# Altium schematic sheet 4layer schematic.SchDoc: Power Bank   by Abdelrahman Ahmed (part 3 of 3)
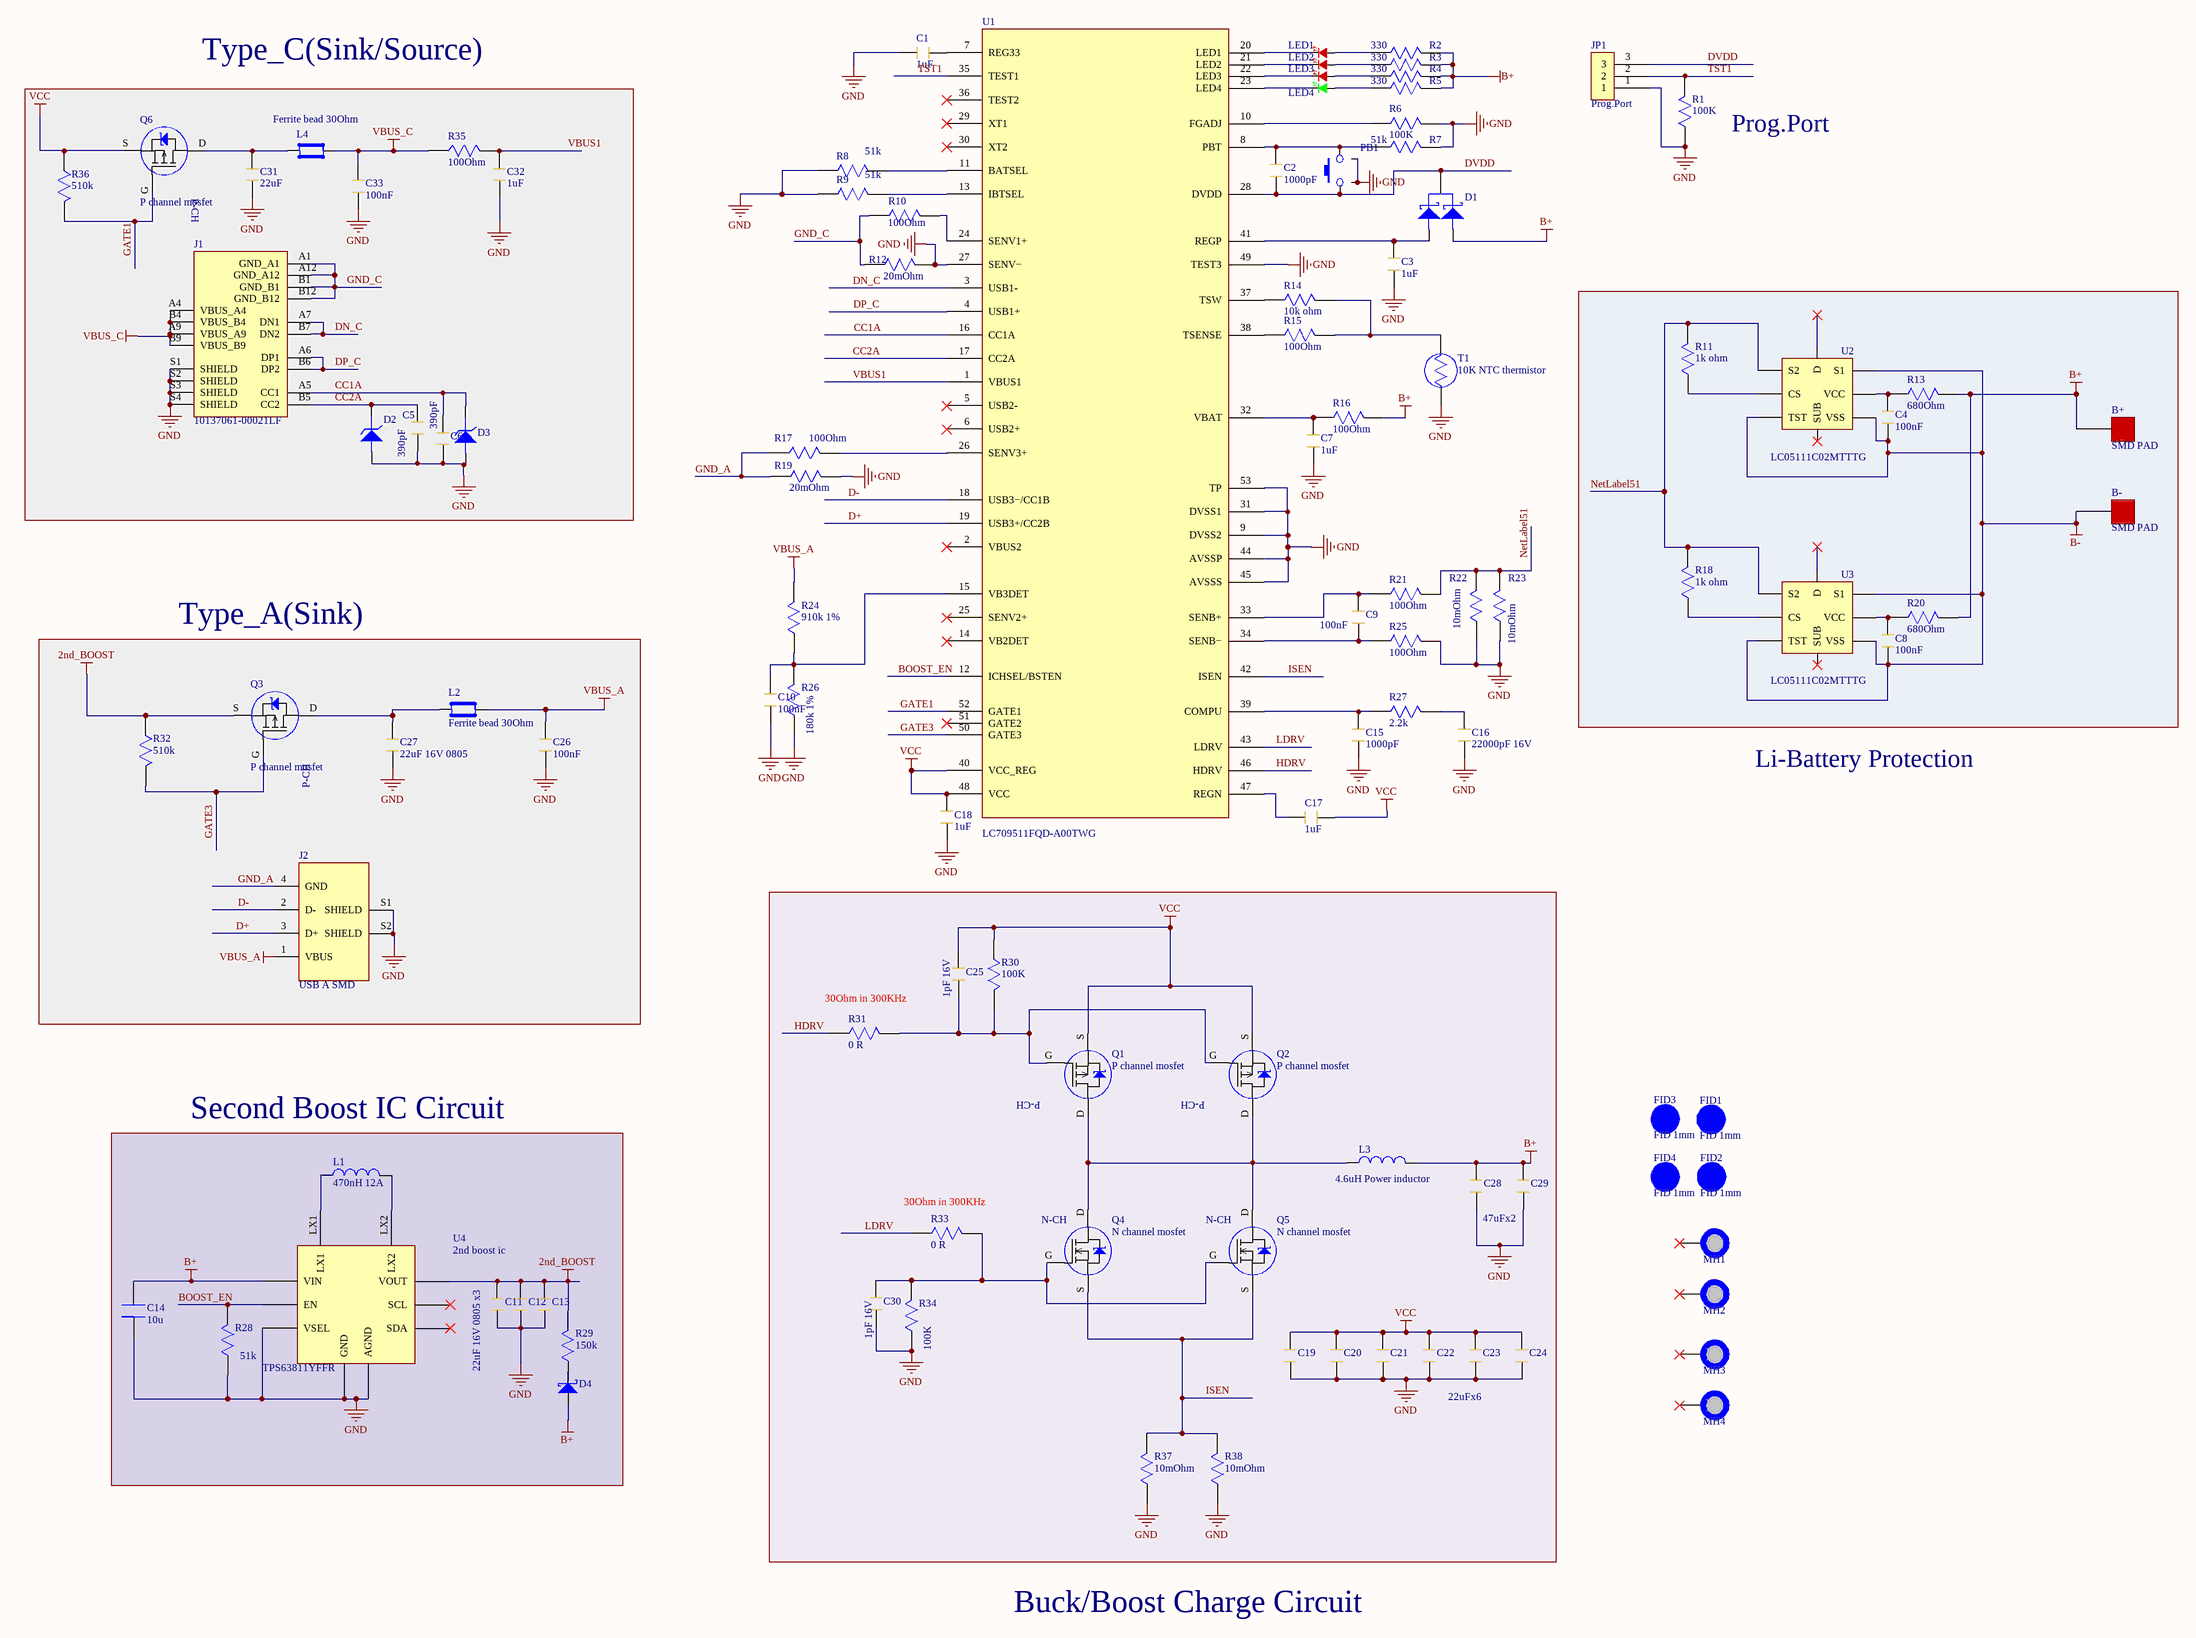
[diagram p2: 4layer schematic.SchDoc]

## Library data of the parts (continued)
R7-R9 R28 = CRCW080551K0JNEA: RES, THICK FILM, 51K, 5%, 0.125W, 0805, REEL; Product Range:AEC-Q200 CRCW Series; Resistance:51kohm; Power Rating:125mW; Resistance Tolerance: 5%; Voltage Rating:150V; Resistor Case Style:0805 [2012 Metric]; Packaging:Tape & Reel ;RoHS Compliant: Yes; Manufacturer 1: Vishay Dale; Resistance: 51kR; Power Rating: 125mW; Voltage Rating: 150V; Temperature Coefficient: 200ppm/°C; Supplier 1: Digi-Key; Manufacturer Part Number 1: CRCW080551K0JNEA; Stock 1: 39035; Pricing 1: 1=0.10000, 10=0.03800, 100=0.01560, 1000=0.00702, 2500=0.00610 (USD); RoHS: Yes; Case/Package: 0805; Number of Pins: 2; Weight: 0.000194oz; Case Code (Imperial): 0805; Case Code (Metric): 2012; Contact Plating: Tin; Min Operating Temperature: -55°C; Max Operating Temperature: 155°C; Tolerance: 5%; Packaging: Tape and Reel; Package Quantity: 1; Termination: SMD/SMT; Composition: Thick Film; Number of Terminations: 2; Military Standard: Not; Max Power Dissipation: 125mW; Voltage Rating (DC): 150V; Features: Automotive AEC-Q200; Working Voltage: 150V; Length: 2mm; Height: 0.02inch; Width: 1.25mm; Depth: 1.25mm; Radiation Hardening: No; REACH SVHC: Unknown; Lead Free: Lead Free; ComponentLink1URL: https://datasheet.ciiva.com/9002/dcrcwe3-9002680.pdf?src-supplier=Avnet; ComponentLink1Description: https://datasheet.ciiva.com/9002/dcrcwe3-9002680.pdf?src-supplier=Avnet; ComponentLink2URL: https://datasheet.ciiva.com/2464/dcrcwe3-2464858.pdf?src-supplier=Digi-Key; ComponentLink2Description: https://datasheet.ciiva.com/2464/dcrcwe3-2464858.pdf?src-supplier=Digi-Key; ComponentLink3URL: https://datasheet.ciiva.com/2464/dcrcwe3-2464859.pdf?src-supplier=Digi-Key; ComponentLink3Description: https://datasheet.ciiva.com/2464/dcrcwe3-2464859.pdf?src-supplier=Digi-Key; ComponentLink4URL: https://datasheet.ciiva.com/2464/dcrcwe3-2464860.pdf?src-supplier=Digi-Key; ComponentLink4Description: https://datasheet.ciiva.com/2464/dcrcwe3-2464860.pdf?src-supplier=Digi-Key; Supplier Part Number 1: 541-51KACT-ND
R10 R15-R17 R21 R25 R35 = ESR03EZPJ101: ROHM - ESR03EZPJ101 - SMD Chip Resistor, Anti-Surge, 0603 [1608 Metric], 100 ohm, ESR Series, 150 V, Thick Film, 250 mW - SMD Chip Resistor, Anti-Surge, 0603 [1608 Metric], 100 ohm, ESR Series, 150 V, Thick Film, 250 mW; Temperature Coefficient: 200ppm/°C; Power Rating: 200mW; Resistance: 100R; Tolerance: 5%; Supplier 1: Digi-Key; Manufacturer 1: Rohm; Manufacturer Part Number 1: ESR03EZPJ101; Stock 1: 68293; Pricing 1: 1=0.10000, 10=0.07600, 100=0.02920, 1000=0.01283, 2500=0.01108 (USD); RoHS: Yes; Case/Package: 0603; Lead Free: Lead Free; ComponentLink1URL: https://datasheet.ciiva.com/16218/esr-16218543.pdf?src-supplier=Future+Electronics; ComponentLink1Description: https://datasheet.ciiva.com/16218/esr-16218543.pdf?src-supplier=Future+Electronics; Supplier Part Number 1: RHM100DCT-ND
R11 R18 = RC0805FR-071KL: RES SMD 1K OHM 1% 1/8W 0805; Manufacturer 1: Yageo; Resistance: 1kR; Temperature Coefficient: 100ppm/°C; Voltage Rating (DC): 150V; Power Rating: 125mW; Supplier 1: Digi-Key; Manufacturer Part Number 1: RC0805FR-071KL; Stock 1: 26611077; Pricing 1: 1=0.10000, 10=0.04200, 100=0.01700, 1000=0.00762, 2500=0.00662 (USD); RoHS: Yes; Case/Package: 0805; Number of Pins: 2; Case Code (Metric): 2012; Case Code (Imperial): 0805; Min Operating Temperature: -55°C; Max Operating Temperature: 155°C; Tolerance: 1%; Packaging: Tape and Reel; Composition: Thick Film; Package Quantity: 1; Voltage Rating: 150V; Number of Terminations: 2; Termination: SMD/SMT; Military Standard: Not; Max Power Dissipation: 125mW; Features: Moisture Resistant; Length: 0.079inch; Height: 0.024inch; Width: 0.049inch; Depth: 1.25mm; REACH SVHC: Unknown; Lead Free: Lead Free; ComponentLink1URL: https://datasheet.ciiva.com/2456/pyu-r-int-thick-7-2456976.pdf?src-supplier=Digi-Key; ComponentLink1Description: https://datasheet.ciiva.com/2456/pyu-r-int-thick-7-2456976.pdf?src-supplier=Digi-Key; ComponentLink2URL: https://datasheet.ciiva.com/2456/pyu-r-int-thick-7-2456977.pdf?src-supplier=Digi-Key; ComponentLink2Description: https://datasheet.ciiva.com/2456/pyu-r-int-thick-7-2456977.pdf?src-supplier=Digi-Key; ComponentLink3URL: https://datasheet.ciiva.com/7941/1686128-7941719.pdf?src-supplier=Element14; ComponentLink3Description: https://datasheet.ciiva.com/7941/1686128-7941719.pdf?src-supplier=Element14; ComponentLink4URL: https://datasheet.ciiva.com/16850/rc0805-16850409.pdf?src-supplier=Future+Electronics; ComponentLink4Description: https://datasheet.ciiva.com/16850/rc0805-16850409.pdf?src-supplier=Future+Electronics; ComponentLink5URL: https://datasheet.ciiva.com/46385/444164-46385020.pdf?src-supplier=Element14; ComponentLink5Description: https://datasheet.ciiva.com/46385/444164-46385020.pdf?src-supplier=Element14; ComponentLink6URL: https://datasheet.ciiva.com/2456/pyu-r-int-thick-7-2456975.pdf?src-supplier=Digi-Key; ComponentLink6Description: https://datasheet.ciiva.com/2456/pyu-r-int-thick-7-2456975.pdf?src-supplier=Digi-Key; Supplier Part Number 1: 311-1.00KCRCT-ND
R12 R19 = ERJ8CWFR020V: PANASONIC - ERJ8CWFR020V - SMD Current Sense Resistors, AEC-Q200 ERJ Series, 0.02 ohm, 1 W, - 1% RoHS Compliant: Yes; Resistance: 20mR; Power Rating: 1W; Temperature Coefficient: 75ppm/°C; Supplier 1: Digi-Key; Manufacturer 1: Panasonic; Manufacturer Part Number 1: ERJ8CWFR020V; Stock 1: 13226; Pricing 1: 1=0.59000, 10=0.45200, 100=0.19000, 1000=0.10482, 2500=0.09826 (USD); RoHS: Yes; Mount: Surface Mount; Case/Package: 1206; Case Code (Metric): 3216; Case Code (Imperial): 1206; Min Operating Temperature: -55°C; Max Operating Temperature: 155°C; Tolerance: 1%; Packaging: Cut Tape; Composition: Thick Film; Number of Terminations: 2; Termination: Flat; Max Power Dissipation: 1W; Features: Automotive AEC-Q200; Length: 0.126inch; Height: 0.03inch; Width: 0.063inch; Depth: 1.6mm; REACH SVHC: No SVHC; Lead Free: Lead Free; ComponentLink1URL: https://datasheet.ciiva.com/25608/0900766b81107548-25608662.pdf?src-supplier=RSComponents; ComponentLink1Description: https://datasheet.ciiva.com/25608/0900766b81107548-25608662.pdf?src-supplier=RSComponents; ComponentLink2URL: https://datasheet.ciiva.com/7942/1790602-7942325.pdf?src-supplier=Element14; ComponentLink2Description: https://datasheet.ciiva.com/7942/1790602-7942325.pdf?src-supplier=Element14; ComponentLink3URL: https://datasheet.ciiva.com/48532/erj8cw-eng-tds-48532710.pdf?src-supplier=Distrelec; ComponentLink3Description: https://datasheet.ciiva.com/48532/erj8cw-eng-tds-48532710.pdf?src-supplier=Distrelec; ComponentLink4URL: https://datasheet.ciiva.com/6028/1790602-6028444.pdf?src-supplier=Farnell; ComponentLink4Description: https://datasheet.ciiva.com/6028/1790602-6028444.pdf?src-supplier=Farnell; Supplier Part Number 1: P0.02BVCT-ND
R13 R20 = 680Ohm 1/8 watt: PANASONIC ELECTRONIC COMPONENTS         ERJ6ENF6800V            Surface Mount Chip Resistor, Thick Film, AEC-Q200 ERJ6E Series, 680 ohm, 125 mW,  1%, 150 V; Resistance: 680R; Power Rating: 125mW; Voltage Rating: 150V; Temperature Coefficient: 100ppm/°C; Supplier 1: Digi-Key; Manufacturer 1: Panasonic; Manufacturer Part Number 1: ERJ6ENF6800V; Stock 1: 52236; Pricing 1: 1=0.10000, 10=0.07200, 100=0.02750, 1000=0.01210, 2500=0.01045 (USD); RoHS: Yes; Mount: Surface Mount; Case/Package: 0805; Number of Pins: 2; Case Code (Metric): 2012; Case Code (Imperial): 0805; Contact Plating: Tin; Min Operating Temperature: -55°C; Max Operating Temperature: 155°C; Packaging: Tape and Reel; Tolerance: 1%; Composition: Thick Film; Package Quantity: 1; Number of Terminations: 2; Termination: SMD/SMT; Military Standard: Not; Max Power Dissipation: 125mW; Features: Automotive AEC-Q200; Length: 2mm; Height: 0.6mm; Width: 0.049inch; Depth: 1.25mm; Radiation Hardening: No; REACH SVHC: No SVHC; ComponentLink1URL: https://datasheet.ciiva.com/11821/0900766b80f80784-11821688.pdf?src-supplier=RSComponents; ComponentLink1Description: https://datasheet.ciiva.com/11821/0900766b80f80784-11821688.pdf?src-supplier=RSComponents; ComponentLink2URL: https://datasheet.ciiva.com/7944/426256-7944661.pdf?src-supplier=Element14; ComponentLink2Description: https://datasheet.ciiva.com/7944/426256-7944661.pdf?src-supplier=Element14; ComponentLink3URL: https://datasheet.ciiva.com/16787/70260748-16787589.pdf?src-supplier=Allied+Electronics; ComponentLink3Description: https://datasheet.ciiva.com/16787/70260748-16787589.pdf?src-supplier=Allied+Electronics; ComponentLink4URL: https://datasheet.ciiva.com/17205/aoa0000ce2-17205287.pdf?src-supplier=Avnet+Europe; ComponentLink4Description: https://datasheet.ciiva.com/17205/aoa0000ce2-17205287.pdf?src-supplier=Avnet+Europe; ComponentLink5URL: https://datasheet.ciiva.com/7944/426256-7944953.pdf?src-supplier=Element14; ComponentLink5Description: https://datasheet.ciiva.com/7944/426256-7944953.pdf?src-supplier=Element14; ComponentLink6URL: https://datasheet.ciiva.com/5860/426256-5860698.pdf?src-supplier=Farnell; ComponentLink6Description: https://datasheet.ciiva.com/5860/426256-5860698.pdf?src-supplier=Farnell; ComponentLink7URL: https://datasheet.ciiva.com/16512/aoa0000ce2-16512058.pdf?src-supplier=Avnet+Asia; ComponentLink7Description: https://datasheet.ciiva.com/16512/aoa0000ce2-16512058.pdf?src-supplier=Avnet+Asia; ComponentLink8URL: https://datasheet.ciiva.com/9180/aoa0000ce2-9180429.pdf?src-supplier=Avnet; ComponentLink8Description: https://datasheet.ciiva.com/9180/aoa0000ce2-9180429.pdf?src-supplier=Avnet; ComponentLink9URL: https://datasheet.ciiva.com/16757/70260748-16757933.pdf?src-supplier=Allied+Electronics; ComponentLink9Description: https://datasheet.ciiva.com/16757/70260748-16757933.pdf?src-supplier=Allied+Electronics; ComponentLink10URL: https://datasheet.ciiva.com/30107/aoa0000ce2-30107005.pdf?src-supplier=Onlinecomponents.com; ComponentLink10Description: https://datasheet.ciiva.com/30107/aoa0000ce2-30107005.pdf?src-supplier=Onlinecomponents.com; ComponentLink11URL: https://datasheet.ciiva.com/46373/1678782-46373886.pdf?src-supplier=Element14; ComponentLink11Description: https://datasheet.ciiva.com/46373/1678782-46373886.pdf?src-supplier=Element14; ComponentLink12URL: https://datasheet.ciiva.com/46373/1678782-46373887.pdf?src-supplier=Element14; ComponentLink12Description: https://datasheet.ciiva.com/46373/1678782-46373887.pdf?src-supplier=Element14; Supplier Part Number 1: P680CCT-ND
R14 = RC0805FR-0710KL: RES SMD 10K OHM 1% 1/8W 0805; Manufacturer 1: Yageo; Resistance: 10kR; Temperature Coefficient: 100ppm/°C; Power Rating: 125mW; Voltage Rating: 150V; Supplier 1: Digi-Key; Manufacturer Part Number 1: RC0805FR-0710KL; Stock 1: 38785407; Pricing 1: 1=0.10000, 10=0.04200, 100=0.01700, 1000=0.00762, 2500=0.00662 (USD); RoHS: Yes; Case/Package: 0805; Case Code (Imperial): 0805; Case Code (Metric): 2012; Min Operating Temperature: -55°C; Max Operating Temperature: 155°C; Tolerance: 1%; Composition: Thick Film; Packaging: Tape and Reel; Package Quantity: 1; Termination: SMD/SMT; Number of Terminations: 2; Military Standard: Not; Max Power Dissipation: 125mW; Features: Moisture Resistant; Length: 2mm; Height: 0.024inch; Width: 0.049inch; Depth: 1.25mm; REACH SVHC: Unknown; Lead Free: Lead Free; ComponentLink1URL: https://datasheet.ciiva.com/11808/0900766b8106beab-11808151.pdf?src-supplier=RSComponents; ComponentLink1Description: https://datasheet.ciiva.com/11808/0900766b8106beab-11808151.pdf?src-supplier=RSComponents; ComponentLink2URL: https://datasheet.ciiva.com/12669/rc0805-12669688.pdf?src-supplier=Mouser; ComponentLink2Description: https://datasheet.ciiva.com/12669/rc0805-12669688.pdf?src-supplier=Mouser; ComponentLink3URL: https://datasheet.ciiva.com/46447/444164-46447563.pdf?src-supplier=Element14; ComponentLink3Description: https://datasheet.ciiva.com/46447/444164-46447563.pdf?src-supplier=Element14; ComponentLink4URL: https://datasheet.ciiva.com/2456/pyu-r-int-thick-7-2456972.pdf?src-supplier=Digi-Key; ComponentLink4Description: https://datasheet.ciiva.com/2456/pyu-r-int-thick-7-2456972.pdf?src-supplier=Digi-Key; ComponentLink5URL: https://datasheet.ciiva.com/2456/pyu-r-int-thick-7-2456973.pdf?src-supplier=Digi-Key; ComponentLink5Description: https://datasheet.ciiva.com/2456/pyu-r-int-thick-7-2456973.pdf?src-supplier=Digi-Key; ComponentLink6URL: https://datasheet.ciiva.com/2456/pyu-r-int-thick-7-2456974.pdf?src-supplier=Digi-Key; ComponentLink6Description: https://datasheet.ciiva.com/2456/pyu-r-int-thick-7-2456974.pdf?src-supplier=Digi-Key; ComponentLink7URL: https://datasheet.ciiva.com/16747/rc0805-16747087.pdf?src-supplier=Future+Electronics; ComponentLink7Description: https://datasheet.ciiva.com/16747/rc0805-16747087.pdf?src-supplier=Future+Electronics; Supplier Part Number 1: 311-10.0KCRCT-ND
R22 R23 R37 R38 = ERJ-8BWFR010V: PANASONIC - ERJ-8BWFR010V - SMD Current Sense Resistor, 0.01 ohm, ERJ8B Series, 1206 [3216 Metric], 1 W, ± 1%, Thick Film; Resistance: 10mR; Power Rating: 1W; Temperature Coefficient: 200ppm/°C; Supplier 1: Digi-Key; Manufacturer 1: Panasonic; Manufacturer Part Number 1: ERJ-8BWFR010V; Stock 1: 16754; Pricing 1: 1=0.60000, 10=0.50000, 100=0.33550, 1000=0.19632, 2500=0.19418 (USD); RoHS: Yes; Mount: Surface Mount; Case/Package: 1206; Case Code (Imperial): 1206; Case Code (Metric): 3216; Contact Plating: Tin; Min Operating Temperature: -55°C; Max Operating Temperature: 155°C; Tolerance: 1%; Packaging: Tape and Reel; Package Quantity: 1; Composition: Thick Film,Low-Ohm-Resistor; Termination: SMD/SMT; Number of Terminations: 2; Military Standard: Not; Max Power Dissipation: 1W; Features: Automotive AEC-Q200; Length: 3.2mm; Height: 0.65mm; Width: 1.6mm; Depth: 1.6mm; Radiation Hardening: No; REACH SVHC: No SVHC; Lead Free: Lead Free; ComponentLink1URL: https://datasheet.ciiva.com/11811/0900766b8126441d-11811746.pdf?src-supplier=RSComponents; ComponentLink1Description: https://datasheet.ciiva.com/11811/0900766b8126441d-11811746.pdf?src-supplier=RSComponents; ComponentLink2URL: https://datasheet.ciiva.com/9194/aoa0000ce3-9194119.pdf?src-supplier=Avnet; ComponentLink2Description: https://datasheet.ciiva.com/9194/aoa0000ce3-9194119.pdf?src-supplier=Avnet; ComponentLink3URL: https://datasheet.ciiva.com/30095/6aoa0000ce3-30095514.pdf?src-supplier=Onlinecomponents.com; ComponentLink3Description: https://datasheet.ciiva.com/30095/6aoa0000ce3-30095514.pdf?src-supplier=Onlinecomponents.com; ComponentLink4URL: https://datasheet.ciiva.com/48532/erj-eng-tds-48532746.pdf?src-supplier=Distrelec; ComponentLink4Description: https://datasheet.ciiva.com/48532/erj-eng-tds-48532746.pdf?src-supplier=Distrelec; ComponentLink5URL: https://datasheet.ciiva.com/2451/aoa0000ce3-2451517.pdf?src-supplier=Digi-Key; ComponentLink5Description: https://datasheet.ciiva.com/2451/aoa0000ce3-2451517.pdf?src-supplier=Digi-Key; ComponentLink6URL: https://datasheet.ciiva.com/2451/aoa0000ce3-2451518.pdf?src-supplier=Digi-Key; ComponentLink6Description: https://datasheet.ciiva.com/2451/aoa0000ce3-2451518.pdf?src-supplier=Digi-Key; ComponentLink7URL: https://datasheet.ciiva.com/17212/aoa0000ce3-17212030.pdf?src-supplier=Avnet+Europe; ComponentLink7Description: https://datasheet.ciiva.com/17212/aoa0000ce3-17212030.pdf?src-supplier=Avnet+Europe; ComponentLink8URL: https://datasheet.ciiva.com/2451/aoa0000ce3-2451519.pdf?src-supplier=Digi-Key; ComponentLink8Description: https://datasheet.ciiva.com/2451/aoa0000ce3-2451519.pdf?src-supplier=Digi-Key; ComponentLink9URL: https://datasheet.ciiva.com/28532/39793-28532991.pdf?src-supplier=Element14; ComponentLink9Description: https://datasheet.ciiva.com/28532/39793-28532991.pdf?src-supplier=Element14; Supplier Part Number 1: P.010AUCT-ND
R24 = ERJ-6ENF9101V: Res Thick Film 0805 9.1K Ohm 1% 1/8W +/-100ppm/ßC Molded SMD Punched Carrier T/R; Manufacturer 1: Panasonic; Resistance: 9.1kR; Power Rating: 125mW; Voltage Rating: 150V; Temperature Coefficient: 100ppm/°C; Supplier 1: Digi-Key; Manufacturer Part Number 1: ERJ-6ENF9101V; Stock 1: 3180; Pricing 1: 1=0.10000, 10=0.07200, 100=0.02750, 1000=0.01210, 2500=0.01045 (USD); RoHS: Yes; Mount: Surface Mount; Case/Package: 0805; Case Code (Imperial): 0805; Case Code (Metric): 2012; Contact Plating: Tin; Min Operating Temperature: -55°C; Max Operating Temperature: 155°C; Tolerance: 1%; Packaging: Tape and Reel; Package Quantity: 1; Composition: Thick Film; Number of Terminations: 2; Military Standard: Not; Max Power Dissipation: 125mW; Features: Automotive AEC-Q200; Termination: SMD/SMT; Voltage Rating (DC): 150V; Length: 2mm; Height: 0.6mm; Width: 1.2mm; Depth: 1.25mm; Radiation Hardening: No; REACH SVHC: No SVHC; Lead Free: Lead Free; ComponentLink1URL: https://datasheet.ciiva.com/11821/0900766b80f80784-11821718.pdf?src-supplier=RSComponents; ComponentLink1Description: https://datasheet.ciiva.com/11821/0900766b80f80784-11821718.pdf?src-supplier=RSComponents; ComponentLink2URL: https://datasheet.ciiva.com/16437/aoa0000ce2-16437783.pdf?src-supplier=Future+Electronics; ComponentLink2Description: https://datasheet.ciiva.com/16437/aoa0000ce2-16437783.pdf?src-supplier=Future+Electronics; ComponentLink3URL: https://datasheet.ciiva.com/30163/aoa0000ce2-30163272.pdf?src-supplier=Onlinecomponents.com; ComponentLink3Description: https://datasheet.ciiva.com/30163/aoa0000ce2-30163272.pdf?src-supplier=Onlinecomponents.com; ComponentLink4URL: https://datasheet.ciiva.com/16766/70260748-16766713.pdf?src-supplier=Allied+Electronics; ComponentLink4Description: https://datasheet.ciiva.com/16766/70260748-16766713.pdf?src-supplier=Allied+Electronics; ComponentLink5URL: https://datasheet.ciiva.com/16785/70260748-16785210.pdf?src-supplier=Allied+Electronics; ComponentLink5Description: https://datasheet.ciiva.com/16785/70260748-16785210.pdf?src-supplier=Allied+Electronics; ComponentLink6URL: https://datasheet.ciiva.com/17212/aoa0000ce2-17212221.pdf?src-supplier=Avnet+Europe; ComponentLink6Description: https://datasheet.ciiva.com/17212/aoa0000ce2-17212221.pdf?src-supplier=Avnet+Europe; Supplier Part Number 1: P9.10KCCT-ND
R26 = ERJ-6ENF1803V: Thick Film Resistors - SMD 0805 180Kohms 1% AEC-Q200; Manufacturer 1: Panasonic; Resistance: 180kR; Power Rating: 125mW; Voltage Rating: 150V; Temperature Coefficient: 100ppm/°C; Supplier 1: Digi-Key; Manufacturer Part Number 1: ERJ-6ENF1803V; Stock 1: 39178; Pricing 1: 1=0.10000, 10=0.08500, 100=0.03290, 1000=0.01445, 2500=0.01248 (USD); RoHS: Yes; Mount: Surface Mount; Case/Package: 0805; Number of Pins: 2; Case Code (Metric): 2012; Case Code (Imperial): 0805; Contact Plating: Tin; Min Operating Temperature: -55°C; Max Operating Temperature: 155°C; Tolerance: 1%; Packaging: Tape and Reel; Package Quantity: 1; Composition: Thick Film; Number of Terminations: 2; Termination: SMD/SMT; Military Standard: Not; Max Power Dissipation: 125mW; Voltage Rating (DC): 150V; Features: Automotive AEC-Q200; Length: 2mm; Height: 0.6mm; Width: 0.049inch; Depth: 1.25mm; Radiation Hardening: No; REACH SVHC: No SVHC; ComponentLink1URL: https://datasheet.ciiva.com/11821/0900766b80f80784-11821551.pdf?src-supplier=RSComponents; ComponentLink1Description: https://datasheet.ciiva.com/11821/0900766b80f80784-11821551.pdf?src-supplier=RSComponents; ComponentLink2URL: https://datasheet.ciiva.com/16758/70260748-16758997.pdf?src-supplier=Allied+Electronics; ComponentLink2Description: https://datasheet.ciiva.com/16758/70260748-16758997.pdf?src-supplier=Allied+Electronics; ComponentLink3URL: https://datasheet.ciiva.com/7836/426256-7836822.pdf?src-supplier=Element14; ComponentLink3Description: https://datasheet.ciiva.com/7836/426256-7836822.pdf?src-supplier=Element14; ComponentLink4URL: https://datasheet.ciiva.com/7836/426256-7836535.pdf?src-supplier=Element14; ComponentLink4Description: https://datasheet.ciiva.com/7836/426256-7836535.pdf?src-supplier=Element14; ComponentLink5URL: https://datasheet.ciiva.com/9185/aoa0000ce2-9185015.pdf?src-supplier=Avnet; ComponentLink5Description: https://datasheet.ciiva.com/9185/aoa0000ce2-9185015.pdf?src-supplier=Avnet; ComponentLink6URL: https://datasheet.ciiva.com/46398/1678782-46398137.pdf?src-supplier=Element14; ComponentLink6Description: https://datasheet.ciiva.com/46398/1678782-46398137.pdf?src-supplier=Element14; ComponentLink7URL: https://datasheet.ciiva.com/5915/426256-5915338.pdf?src-supplier=Farnell; ComponentLink7Description: https://datasheet.ciiva.com/5915/426256-5915338.pdf?src-supplier=Farnell; ComponentLink8URL: https://datasheet.ciiva.com/17207/aoa0000ce2-17207210.pdf?src-supplier=Avnet+Europe; ComponentLink8Description: https://datasheet.ciiva.com/17207/aoa0000ce2-17207210.pdf?src-supplier=Avnet+Europe; ComponentLink9URL: https://datasheet.ciiva.com/28568/1678782-28568746.pdf?src-supplier=Element14; ComponentLink9Description: https://datasheet.ciiva.com/28568/1678782-28568746.pdf?src-supplier=Element14; ComponentLink10URL: https://datasheet.ciiva.com/46398/1678782-46398138.pdf?src-supplier=Element14; ComponentLink10Description: https://datasheet.ciiva.com/46398/1678782-46398138.pdf?src-supplier=Element14; ComponentLink11URL: https://datasheet.ciiva.com/22681/1678782-22681691.pdf?src-supplier=Element14; ComponentLink11Description: https://datasheet.ciiva.com/22681/1678782-22681691.pdf?src-supplier=Element14; ComponentLink12URL: https://datasheet.ciiva.com/16780/70260748-16780877.pdf?src-supplier=Allied+Electronics; ComponentLink12Description: https://datasheet.ciiva.com/16780/70260748-16780877.pdf?src-supplier=Allied+Electronics; ComponentLink13URL: https://datasheet.ciiva.com/30187/aoa0000ce2-30187757.pdf?src-supplier=Onlinecomponents.com; ComponentLink13Description: https://datasheet.ciiva.com/30187/aoa0000ce2-30187757.pdf?src-supplier=Onlinecomponents.com; ComponentLink14URL: https://datasheet.ciiva.com/24024/aoa0000ce2-24024447.pdf?src-supplier=Mouser; ComponentLink14Description: https://datasheet.ciiva.com/24024/aoa0000ce2-24024447.pdf?src-supplier=Mouser; Supplier Part Number 1: P180KCCT-ND
R27 = RC0805FR-072K2L: RESISTOR, THICK FILM, 2.2KOHM, 125mW, 1%, FULL REEL; Manufacturer 1: Yageo; Temperature Coefficient: 100ppm/°C; Resistance: 2.2kR; Voltage Rating: 150V; Supplier 1: Digi-Key; Manufacturer Part Number 1: RC0805FR-072K2L; Stock 1: 3046359; Pricing 1: 1=0.10000, 10=0.03900, 100=0.01570, 1000=0.00705, 2500=0.00612 (USD); RoHS: Yes; Case/Package: 0805; Number of Pins: 2; Case Code (Imperial): 0805; Case Code (Metric): 2012; Min Operating Temperature: -55°C; Max Operating Temperature: 155°C; Tolerance: 1%; Power Rating: 125mW; Packaging: Tape and Reel; Termination: SMD/SMT; Composition: Thick Film; Number of Terminations: 2; Max Power Dissipation: 125mW; Voltage Rating (DC): 150V; Package Quantity: 1; Features: Moisture Resistant; Military Standard: Not; Length: 2mm; Height: 0.5mm; Depth: 1.25mm; Width: 1.25mm; Lead Pitch: 0.4mm; REACH SVHC: Unknown; Lead Free: Lead Free; ComponentLink1URL: https://datasheet.ciiva.com/7660/38627-7660800.pdf?src-supplier=Element14; ComponentLink1Description: https://datasheet.ciiva.com/7660/38627-7660800.pdf?src-supplier=Element14; ComponentLink2URL: https://datasheet.ciiva.com/11808/0900766b8106beab-11808373.pdf?src-supplier=RSComponents; ComponentLink2Description: https://datasheet.ciiva.com/11808/0900766b8106beab-11808373.pdf?src-supplier=RSComponents; ComponentLink3URL: https://datasheet.ciiva.com/46447/444164-46447575.pdf?src-supplier=Element14; ComponentLink3Description: https://datasheet.ciiva.com/46447/444164-46447575.pdf?src-supplier=Element14; ComponentLink4URL: https://datasheet.ciiva.com/2457/pyu-r-int-thick-7-2457002.pdf?src-supplier=Digi-Key; ComponentLink4Description: https://datasheet.ciiva.com/2457/pyu-r-int-thick-7-2457002.pdf?src-supplier=Digi-Key; ComponentLink5URL: https://datasheet.ciiva.com/7941/444164-7941754.pdf?src-supplier=Element14; ComponentLink5Description: https://datasheet.ciiva.com/7941/444164-7941754.pdf?src-supplier=Element14; ComponentLink6URL: https://datasheet.ciiva.com/2457/pyu-r-int-thick-7-2457003.pdf?src-supplier=Digi-Key; ComponentLink6Description: https://datasheet.ciiva.com/2457/pyu-r-int-thick-7-2457003.pdf?src-supplier=Digi-Key; ComponentLink7URL: https://datasheet.ciiva.com/7941/444164-7941755.pdf?src-supplier=Element14; ComponentLink7Description: https://datasheet.ciiva.com/7941/444164-7941755.pdf?src-supplier=Element14; ComponentLink8URL: https://datasheet.ciiva.com/2457/pyu-r-int-thick-7-2457004.pdf?src-supplier=Digi-Key; ComponentLink8Description: https://datasheet.ciiva.com/2457/pyu-r-int-thick-7-2457004.pdf?src-supplier=Digi-Key; ComponentLink9URL: https://datasheet.ciiva.com/46412/444164-46412862.pdf?src-supplier=Element14; ComponentLink9Description: https://datasheet.ciiva.com/46412/444164-46412862.pdf?src-supplier=Element14; Supplier Part Number 1: 311-2.20KCRCT-ND
R29 = ERJ-6GEYJ154V: RES SMD 150K OHM 5% 1/8W 0805; Manufacturer 1: Panasonic; Resistance: 150kR; Power Rating: 125mW; Voltage Rating: 150V; Temperature Coefficient: 200ppm/°C; Supplier 1: Digi-Key; Manufacturer Part Number 1: ERJ-6GEYJ154V; Stock 1: 100014; Pricing 1: 1=0.10000, 10=0.05200, 100=0.02120, 1000=0.00954, 2500=0.00828 (USD); RoHS: Yes; Mount: Surface Mount; Case/Package: 0805; Case Code (Metric): 2012; Case Code (Imperial): 0805; Contact Plating: Tin; Min Operating Temperature: -55°C; Max Operating Temperature: 155°C; Tolerance: 5%; Packaging: Tape and Reel; Package Quantity: 5000; Composition: Thick Film; Number of Terminations: 2; Military Standard: Not; Termination: SMD/SMT; Max Power Dissipation: 125mW; Voltage Rating (DC): 150V; Length: 2mm; Height: 0.028inch; Width: 0.049inch; Depth: 1.25mm; Radiation Hardening: No; REACH SVHC: No SVHC; Lead Free: Lead Free; ComponentLink1URL: https://datasheet.ciiva.com/3882/41790015s9557575n1386-3882896.pdf?src-supplier=Arrow+Electronics; ComponentLink1Description: https://datasheet.ciiva.com/3882/41790015s9557575n1386-3882896.pdf?src-supplier=Arrow+Electronics; ComponentLink2URL: https://datasheet.ciiva.com/17207/aoa0000ce1-17207480.pdf?src-supplier=Avnet+Europe; ComponentLink2Description: https://datasheet.ciiva.com/17207/aoa0000ce1-17207480.pdf?src-supplier=Avnet+Europe; ComponentLink3URL: https://datasheet.ciiva.com/43460/1500035-43460137.pdf?src-supplier=Farnell; ComponentLink3Description: https://datasheet.ciiva.com/43460/1500035-43460137.pdf?src-supplier=Farnell; ComponentLink4URL: https://datasheet.ciiva.com/46373/1500035-46373995.pdf?src-supplier=Element14; ComponentLink4Description: https://datasheet.ciiva.com/46373/1500035-46373995.pdf?src-supplier=Element14; ComponentLink5URL: https://datasheet.ciiva.com/16781/70255313-16781804.pdf?src-supplier=Allied+Electronics; ComponentLink5Description: https://datasheet.ciiva.com/16781/70255313-16781804.pdf?src-supplier=Allied+Electronics; ComponentLink6URL: https://datasheet.ciiva.com/28691/1678796-28691981.pdf?src-supplier=Element14; ComponentLink6Description: https://datasheet.ciiva.com/28691/1678796-28691981.pdf?src-supplier=Element14; ComponentLink7URL: https://datasheet.ciiva.com/16516/aoa0000ce1-16516415.pdf?src-supplier=Avnet+Asia; ComponentLink7Description: https://datasheet.ciiva.com/16516/aoa0000ce1-16516415.pdf?src-supplier=Avnet+Asia; Supplier Part Number 1: P150KACT-ND
R31 R33 = RC0805JR-070RL: RES SMD 0 OHM JUMPER 1/8W 0805; Manufacturer 1: Yageo; Resistance: 0mR; Tolerance: 5%; Power Rating: 125mW; Voltage Rating: 150V; Temperature Coefficient: 200ppm/°C; Supplier 1: Digi-Key; Manufacturer Part Number 1: RC0805JR-070RL; Stock 1: 14217042; Pricing 1: 1=0.10000, 10=0.03900, 25=0.02840, 50=0.02160, 100=0.01590, 250=0.01216, 500=0.00972, 1000=0.00716 (USD); RoHS: Yes; Case/Package: 0805; Number of Pins: 2; Contact Plating: Tin,Matte; Case Code (Imperial): 0805; Case Code (Metric): 2012; Min Operating Temperature: -55°C; Max Operating Temperature: 155°C; Composition: Thick Film; Packaging: Tape and Reel; Voltage Rating (DC): 150V; Termination: SMD/SMT; Military Standard: Not; Length: 2mm; Height: 0.5mm; Width: 1.25mm; Depth: 1.25mm; Radiation Hardening: No; REACH SVHC: Unknown; Lead Free: Lead Free; ComponentLink1URL: https://datasheet.ciiva.com/7941/1738694-7941861.pdf?src-supplier=Element14; ComponentLink1Description: https://datasheet.ciiva.com/7941/1738694-7941861.pdf?src-supplier=Element14; ComponentLink2URL: https://datasheet.ciiva.com/11819/0900766b8106beab-11819430.pdf?src-supplier=RSComponents; ComponentLink2Description: https://datasheet.ciiva.com/11819/0900766b8106beab-11819430.pdf?src-supplier=RSComponents; ComponentLink3URL: https://datasheet.ciiva.com/7941/1738694-7941862.pdf?src-supplier=Element14; ComponentLink3Description: https://datasheet.ciiva.com/7941/1738694-7941862.pdf?src-supplier=Element14; ComponentLink4URL: https://datasheet.ciiva.com/7941/1738694-7941863.pdf?src-supplier=Element14; ComponentLink4Description: https://datasheet.ciiva.com/7941/1738694-7941863.pdf?src-supplier=Element14; ComponentLink5URL: https://datasheet.ciiva.com/15190/getdatasheetpartid-330685-15190028.pdf?src-supplier=Verical; ComponentLink5Description: https://datasheet.ciiva.com/15190/getdatasheetpartid-330685-15190028.pdf?src-supplier=Verical; Supplier Part Number 1: 311-0.0ARCT-ND
R32 R36 = ERJ-6GEYJ514V: RES SMD 510K OHM 5% 1/8W 0805; Manufacturer 1: Panasonic; Resistance: 510kR; Power Rating: 125mW; Voltage Rating: 150V; Temperature Coefficient: 200ppm/°C; Supplier 1: Digi-Key; Manufacturer Part Number 1: ERJ-6GEYJ514V; Stock 1: 14917; Pricing 1: 1=0.10000, 10=0.05200, 100=0.02120, 1000=0.00954, 2500=0.00828 (USD); RoHS: Yes; Mount: Surface Mount; Case/Package: 0805; Weight: 0.000194oz; Case Code (Metric): 2012; Case Code (Imperial): 0805; Contact Plating: Tin; Min Operating Temperature: -55°C; Max Operating Temperature: 155°C; Tolerance: 5%; Packaging: Tape and Reel; Package Quantity: 5000; Composition: Thick Film; Number of Terminations: 2; Termination: SMD/SMT; Military Standard: Not; Max Power Dissipation: 125mW; Voltage Rating (DC): 150V; Length: 2mm; Height: 0.6mm; Width: 0.049inch; Depth: 1.25mm; REACH SVHC: No SVHC; Lead Free: Contains Lead; ComponentLink1URL: https://datasheet.ciiva.com/30081/4aoa0000ce1-30081333.pdf?src-supplier=Onlinecomponents.com; ComponentLink1Description: https://datasheet.ciiva.com/30081/4aoa0000ce1-30081333.pdf?src-supplier=Onlinecomponents.com; ComponentLink2URL: https://datasheet.ciiva.com/24163/aoa0000ce1-37422-24163640.pdf?src-supplier=Mouser; ComponentLink2Description: https://datasheet.ciiva.com/24163/aoa0000ce1-37422-24163640.pdf?src-supplier=Mouser; ComponentLink3URL: https://datasheet.ciiva.com/43469/1678796-43469657.pdf?src-supplier=Farnell; ComponentLink3Description: https://datasheet.ciiva.com/43469/1678796-43469657.pdf?src-supplier=Farnell; ComponentLink4URL: https://datasheet.ciiva.com/16767/70255313-16767419.pdf?src-supplier=Allied+Electronics; ComponentLink4Description: https://datasheet.ciiva.com/16767/70255313-16767419.pdf?src-supplier=Allied+Electronics; ComponentLink5URL: https://datasheet.ciiva.com/16771/70255313-16771371.pdf?src-supplier=Allied+Electronics; ComponentLink5Description: https://datasheet.ciiva.com/16771/70255313-16771371.pdf?src-supplier=Allied+Electronics; ComponentLink6URL: https://datasheet.ciiva.com/9181/aoa0000ce1-9181469.pdf?src-supplier=Avnet; ComponentLink6Description: https://datasheet.ciiva.com/9181/aoa0000ce1-9181469.pdf?src-supplier=Avnet; ComponentLink7URL: https://datasheet.ciiva.com/8081/aoa0000ce1-8081327.pdf?src-supplier=Element14; ComponentLink7Description: https://datasheet.ciiva.com/8081/aoa0000ce1-8081327.pdf?src-supplier=Element14; Supplier Part Number 1: P510KACT-ND
T1 = RL0503-5820-97-MS: Thermistor, High Sensitivity, NTC, Res 10 Kilohms, Tol +/-2%, Radial, Disc, TC 15Sec.; Manufacturer 1: Amphenol Advanced Sensors; Resistance: 10kR; Tolerance: 2%; Accuracy: 1%; Supplier 1: Digi-Key; Manufacturer Part Number 1: RL0503-5820-97-MS; Stock 1: 40880; Pricing 1: 1=2.02000, 5=1.91400, 10=1.64100, 25=1.31280, 50=1.20340, 100=1.09400, 500=0.95726, 1000=0.84785, 5000=0.79315 (USD); Mount: Free Hanging; Case/Package: Radial; Number of Pins: 2; Min Operating Temperature: -50°C; Max Operating Temperature: 150°C; Package Quantity: 500; Packaging: Bulk; Termination: Radial; Diameter: 2.41mm; Length: 28.7mm; Width: 6.35mm; Lead Pitch: 5.08mm; Lead Free: Lead Free; REACH SVHC: No SVHC; ComponentLink1URL: https://datasheet.ciiva.com/29856/aas-920-574a-thermometrics-ntc-type-ms-032114-web-29856981.pdf?src-supplier=Digi-Key; ComponentLink1Description: https://datasheet.ciiva.com/29856/aas-920-574a-thermometrics-ntc-type-ms-032114-web-29856981.pdf?src-supplier=Digi-Key; ComponentLink2URL: https://datasheet.ciiva.com/46652/70181330-46652421.pdf?src-supplier=Allied+Electronics; ComponentLink2Description: https://datasheet.ciiva.com/46652/70181330-46652421.pdf?src-supplier=Allied+Electronics; ComponentLink3URL: http://datasheet.octopart.com/RL0503-5820-97-MS-Amphenol-Advanced-Sensors-datasheet-32780836.pdf?src-supplier=Newark; ComponentLink3Description: http://datasheet.octopart.com/RL0503-5820-97-MS-Amphenol-Advanced-Sensors-datasheet-32780836.pdf?src-supplier=Newark; ComponentLink4URL: http://datasheet.octopart.com/RL0503-5820-97-MS-Amphenol-Advanced-Sensors-datasheet-11518288.pdf?src-supplier=Allied+Electronics; ComponentLink4Description: http://datasheet.octopart.com/RL0503-5820-97-MS-Amphenol-Advanced-Sensors-datasheet-11518288.pdf?src-supplier=Allied+Electronics; ComponentLink5URL: http://datasheet.octopart.com/RL0503-5820-97-MS-Amphenol-Advanced-Sensors-datasheet-28575.pdf?src-supplier=Farnell; ComponentLink5Description: http://datasheet.octopart.com/RL0503-5820-97-MS-Amphenol-Advanced-Sensors-datasheet-28575.pdf?src-supplier=Farnell; ComponentLink6URL: http://datasheet.octopart.com/RL0503-5820-97-MS-Amphenol-Advanced-Sensors-datasheet-556659.pdf?src-supplier=Future+Electronics; ComponentLink6Description: http://datasheet.octopart.com/RL0503-5820-97-MS-Amphenol-Advanced-Sensors-datasheet-556659.pdf?src-supplier=Future+Electronics; Supplier Part Number 1: KC003T-ND
U1 = LC709511FQD-A00TWG: Power Bank Controller, USB Type-C & Quick Charge™ 3.0, for 1-Cell Li-Ion and Li-Poly Battery; Manufacturer 1: ON Semiconductor; Supplier 1: Arrow; Manufacturer Part Number 1: LC709511FQD-A00TWG; Stock 1: 2696; Pricing 1: 1=3.15600, 10=3.08000, 25=3.03900, 100=2.89000, 250=2.86400, 500=2.83690, 1000=2.81000, 3000=3.45600, 30000=3.42400, 300000=3.22800, 1500000=3.10500, 3000000=3.10300 (USD); RoHS: No; ComponentLink1URL: http://www.onsemi.com/pub/Collateral/LC709511F-D.PDF?src-supplier=Digi-Key; ComponentLink1Description: http://www.onsemi.com/pub/Collateral/LC709511F-D.PDF?src-supplier=Digi-Key; Supplier Part Number 1: LC709511FQD-A00TWG
U2 U3 = LC05111C02MTTTG: IC BATT PROTECTION LI-ION 6WDFN; Manufacturer 1: ON Semiconductor; Fault Protection: Over Current; Operating Supply Current: 3uA; Max Power Dissipation: 350mW; Number of Cells: 1; Operating Supply Voltage: 4.5V; Supplier 1: Digi-Key; Manufacturer Part Number 1: LC05111C02MTTTG; Stock 1: 2451; Pricing 1: 1=1.16000, 10=1.03300, 25=0.98000, 100=0.75250, 250=0.66500, 500=0.63000, 1000=0.49000 (USD); RoHS: Yes; Mount: Surface Mount; Number of Pins: 6; Min Operating Temperature: -40°C; Max Operating Temperature: 85°C; Packaging: Tape and Reel; Package Quantity: 4000; Length: 4mm; Height: 0.8mm; Width: 2.6mm; Radiation Hardening: No; Lead Free: Lead Free; ComponentLink1URL: http://www.mouser.com/ds/2/308/LC05111CMT-D-522471.pdf?src-supplier=Mouser; ComponentLink1Description: http://www.mouser.com/ds/2/308/LC05111CMT-D-522471.pdf?src-supplier=Mouser; ComponentLink2URL: http://www.alliedelec.com/images/products/datasheets/bm/ON_SEMICONDUCTOR/70547338.pdf?src-supplier=Allied+Electronics; ComponentLink2Description: http://www.alliedelec.com/images/products/datasheets/bm/ON_SEMICONDUCTOR/70547338.pdf?src-supplier=Allied+Electronics; ComponentLink3URL: http://www.farnell.com/datasheets/2255349.pdf?src-supplier=Farnell; ComponentLink3Description: http://www.farnell.com/datasheets/2255349.pdf?src-supplier=Farnell; ComponentLink4URL: http://www.onsemi.com/pub/Collateral/ENA2338-D.PDF?src-supplier=Avnet; ComponentLink4Description: http://www.onsemi.com/pub/Collateral/ENA2338-D.PDF?src-supplier=Avnet; ComponentLink5URL: http://www.onsemi.com/pub/Collateral/LC05111CMT-D.PDF?src-supplier=Digi-Key; ComponentLink5Description: http://www.onsemi.com/pub/Collateral/LC05111CMT-D.PDF?src-supplier=Digi-Key; Supplier Part Number 1: LC05111C02MTTTGOSCT-ND
U4 = TPS63811YFFR: Switching mode BUCK/BOOST IC; Manufacturer 1: Texas Instruments; Supplier 1: Digi-Key; Manufacturer Part Number 1: TPS63811YFFR; Stock 1: 680; Pricing 1: 1=2.73000, 10=2.45100, 25=2.31760, 100=1.90550, 250=1.70980, 500=1.64800, 1000=1.36990 (USD); RoHS: No; Supplier Part Number 1: 296-TPS63811YFFRCT-ND